# Altium project MainBoard_V100.PrjPcb (part 2 of 3)

## Sheet MainBoard_V100_BLR.SchDoc
size A4; SheetNumber: 12; SheetTotal: 22; Title_: Base Line Restorer
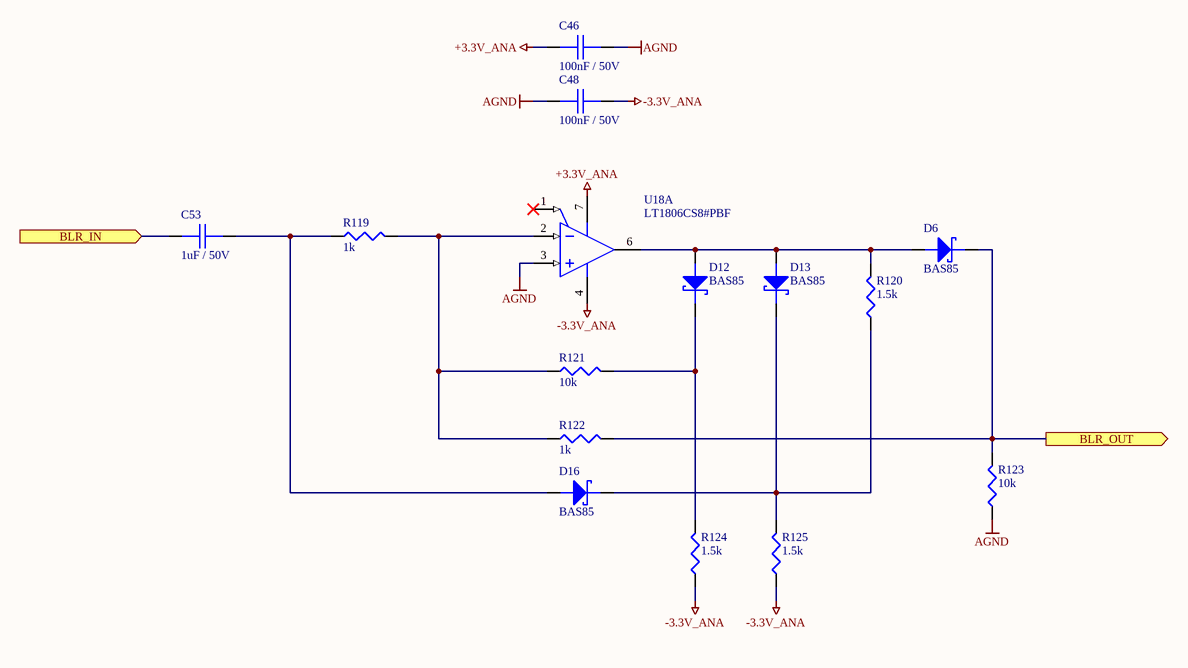
[diagram p10: MainBoard_V100_BLR.SchDoc]

### Parts
C46  100nF / 50V  [0805_C]
C48  100nF / 50V  [0805_C]
C53  1uF / 50V  [0805_C]
D6  BAS85  [SOD80]
D12  BAS85  [SOD80]
D13  BAS85  [SOD80]
D16  BAS85  [SOD80]
R119  1k  [0805]
R120  1.5k  [0805]
R121  10k  [0805]
R122  1k  [0805]
R123  10k  [0805]
R124  1.5k  [0805]
R125  1.5k  [0805]
U18  LT1806CS8#PBF  [SO-8]  (part A of 2)

### Ports
BLR_IN (in), BLR_OUT (out)

### Nets
+3.3V_ANA: C46.1 U18.7(V+)
-3.3V_ANA: C48.2 R124.1 R125.1 U18.4(V-)
AGND: C46.2 C48.1 R123.1 U18.3(+IN)
NetC53_1: C53.1 ; port BLR_IN
NetC53_2: C53.2 D16.A R119.1
NetD6_A: D6.A D12.A D13.A R120.2 U18.6(OUT)
NetD6_K: D6.K R122.2 R123.2 ; port BLR_OUT
NetD12_K: D12.K R121.2 R124.2
NetD13_K: D13.K D16.K R120.1 R125.2
NetR119_2: R119.2 R121.1 R122.1 U18.2(-IN)

Not connected (* = marked no-connect by the designer): U18 1(~{SHDN})*

### Notes on the sheet
- Board:
- Author:
- Title:
- Project:
- SVN:
- Version:
- Sheet:
- of
- Contact:
- Modified:
- Size:
- A4

### Library data of the parts
C46 C48 = 149: as C94 on sheet MainBoard_V100_PSU; Category: Passives; Subcategory: PASS_Capacitor; Supplier 1: HESTORE; Supplier 1 order number: 100.011.22
C53 = 151: 1uF 50V X7R; Part Number: SMD0805-1uF-50V; Azonosító: 151; Category: Passives; Subcategory: PASS_Capacitor; Supplier 1: HESTORE; Supplier 1 order number: 100.330.68
D6 D12 D13 D16 = 371: Small Signal Schottky Diode, Single, 30 V, 200 mA,  125 °C; Azonosító: 371; Part Number: BAS85; Category: Semiconductors; Subcategory: SEMI_Schottky; Supplier 1: HESTORE; Supplier 1 order number: 100.222.42; Supplier 2: FARNELL; Supplier 2 order number: 1097282; Help URL: https://4donline.ihs.com/images/VipMasterIC/IC/NEXP/NEXP-S-A0002881467/NEXP-S-A0002882622-1.pdf?hkey=6D3A4C79FDBF58556ACFDE234799DDF0
R119 R122 = 52: as R40 on sheet MainBoard_V100_PSU_DET; Category: Passives; Subcategory: PASS_Resistor; Supplier 1: HESTORE; Supplier 1 order number: 100.312.99
R120 R124 R125 = 379: 1.5k 0805 0.125W 1%; Part Number: SMD0805-1.5k-1%; Azonosító: 379; Category: Passives; Subcategory: PASS_Resistor; Supplier 1: HESTORE; Supplier 1 order number: 100.327.80
R121 R123 = 59: as R1 on sheet MainBoard_V100_PSU; Category: Passives; Subcategory: PASS_Resistor; Supplier 1: HESTORE; Supplier 1 order number: 100.403.38
U18 = 353: Single Channel, High Speed, Low Noise Precision Operational Amplifier, 325 MHz Typical GBW, 125 V/us Typical SR, 2.5 to 12.6 V, 8-Pin SOIC; Manufacturer: Linear Technology; Linear Technology Part Number: LT1806; Is (mA) Typical: 9; GBW (MHz) Typical: 325; SR (V/us) Typical: 125; Vos (mV) Guaranteed: 0.55; Vos (mV) Typical: 0.1; Vs Max (V): 12.6; Vs Min (V): 2.5; Channels (#): 1; Azonosító: 353; DatasheetVersion: Rev. C; ComponentLink3Description: Package Specification; Mounting Technology: Surface Mount; ComponentLink2Description: Datasheet; RevisionNote: URLs updated; PackageDescription: 8-Pin Plastic Small Outline, Body 4.9 x 3.9 mm, Pitch 1.27 mm; PackageVersion: Rev G; RoHS: Pb-Free; Type: VFB; PackageReference: LT-S8-8; ComponentLink2URL: http://cds.linear.com/docs/en/datasheet/18067fc.pdf; ComponentLink3URL: http://cds.linear.com/docs/en/packaging/05081610_G_SO8.pdf; PartNumber: LT1806CS8#PBF; ComponentLink1Description: Manufacturer URL; ComponentLink1URL: http://www.linear.com/; Part Number: LT1806CS8#PBF; Category: Integrated Circuits; Subcategory: IC_Analog; Supplier 1: MOUSER; Supplier 1 order number: 584-LT1806CS8#PBF; Help URL: https://hu.mouser.com/datasheet/2/609/18067fc-3124195.pdf

## Sheet MainBoard_V100_CSP.SchDoc
size A4; SheetNumber: 11; SheetTotal: 22; Title_: Charge Sensitive Preamplifier
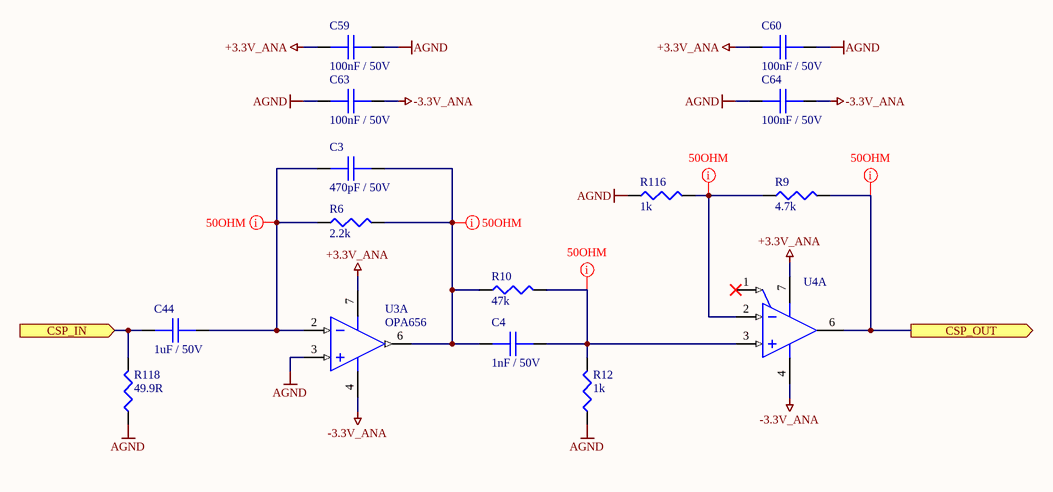
[diagram p11: MainBoard_V100_CSP.SchDoc]

### Parts
C3  470pF / 50V  [0805_C]
C4  1nF / 50V  [0805_C]
C44  1uF / 50V  [0805_C]
C59  100nF / 50V  [0805_C]
C60  100nF / 50V  [0805_C]
C63  100nF / 50V  [0805_C]
C64  100nF / 50V  [0805_C]
R6  2.2k  [0805]
R9  4.7k  [0805]
R10  47k  [0805]
R12  1k  [0805]
R116  1k  [0805]
R118  49.9R  [0805]
U3  OPA656  [SO-8]  (part A of 2)
U4  LT1806CS8#PBF  [SO-8]  (value not drawn)  (part A of 2)

### Ports
CSP_IN (in), CSP_OUT (out)

### Nets
+3.3V_ANA: C59.1 C60.1 U3.7(VS+) U4.7(V+)
-3.3V_ANA: C63.2 C64.2 U3.4(VS-) U4.4(V-)
AGND: C59.2 C60.2 C63.1 C64.1 R12.1 R116.1 R118.1 U3.3(IN+)
NetC3_1: C3.1 C4.1 R6.1 R10.1 U3.6(OUT)
NetC3_2: C3.2 C44.2 R6.2 U3.2(IN-)
NetC4_2: C4.2 R10.2 R12.2 U4.3(+IN)
NetC44_1: C44.1 R118.2 ; port CSP_IN
NetR9_1: R9.1 R116.2 U4.2(-IN)
NetR9_2: R9.2 U4.6(OUT) ; port CSP_OUT

Not connected (* = marked no-connect by the designer): U4 1(~{SHDN})*

### Layout directives
net class 50R: NetC3_1, NetC3_2, NetC4_2, NetR9_1, NetR9_2

### Notes on the sheet
- Board:
- Author:
- Title:
- Project:
- SVN:
- Version:
- Sheet:
- of
- Contact:
- Modified:
- Size:
- A4

### Library data of the parts
C3 = 143: 470 pF 50V X7R; Part Number: SMD0805-470pF-50V; Azonosító: 143; Category: Passives; Subcategory: PASS_Capacitor; Supplier 1: HESTORE; Supplier 1 order number: 100.011.35
C4 = 144: 1nF 50V X7R; Part Number: SMD0805-1nF-50V; Azonosító: 144; Category: Passives; Subcategory: PASS_Capacitor; Supplier 1: HESTORE; Supplier 1 order number: 100.200.70
C44 = 151: as C53 on sheet MainBoard_V100_BLR; Category: Passives; Subcategory: PASS_Capacitor; Supplier 1: HESTORE; Supplier 1 order number: 100.330.68
C59 C60 C63 C64 = 149: as C94 on sheet MainBoard_V100_PSU; Category: Passives; Subcategory: PASS_Capacitor; Supplier 1: HESTORE; Supplier 1 order number: 100.011.22
R6 = 54: 2.2k 0805 0.125W 5%; Part Number: SMD0805-2.2k 5%; Azonosító: 54; Category: Passives; Subcategory: PASS_Resistor; Supplier 1: HESTORE; Supplier 1 order number: 100.406.77
R9 = 56: 4.7k 0805 0.125W 5%; Part Number: SMD0805-4.7k 5%; Azonosító: 56; Category: Passives; Subcategory: PASS_Resistor; Supplier 1: HESTORE; Supplier 1 order number: 100.011.83
R10 = 63: 47k 0805 0.125W 5%; Part Number: SMD0805-47k 5%; Azonosító: 63; Category: Passives; Subcategory: PASS_Resistor; Supplier 1: HESTORE; Supplier 1 order number: 100.011.81
R12 R116 = 52: as R40 on sheet MainBoard_V100_PSU_DET; Category: Passives; Subcategory: PASS_Resistor; Supplier 1: HESTORE; Supplier 1 order number: 100.312.99
R118 = 43: 49.9R 0805 0.125W 1%; Part Number: SMD0805-49.9R 1%; Azonosító: 43; Category: Passives; Subcategory: PASS_Resistor; Supplier 1: HESTORE; Supplier 1 order number: 100.317.46
U3 = 357: Wideband, Unity Gain Stable FET-Input Operational Amplifier, 10 to 12 V, -40 to 85 degC, 8-pin SOIC; PartNumber: OPA656U; Manufacturer: Texas Instruments; BW @ Acl(MHz): 500; Acl, min stable gain(V/V): 1; THD (Fc is 1 MHz)(Typ)(dB): -74; Io(Typ)(mA): 70; @ MHz: 5; Vn at Flatband(Typ)(nV/rtHz): 7; 3rd Harmonic(dBc): 100; Slew Rate(Typ)(V/us): 290; 2nd Harmonic(dBc): 74; Vs(Min)(V): 10; Vs(Max)(V): 12; Iib(Max)(nA): 0.02; Settling Time (0.1%)(Typ)(ns): 16; Vio(Max)(mV): 0.6; Diff Phase(deg): 0.05; Eco-Plan: Green (RoHS & no Sb/Br); Sub Family: High Output Current Amplifier (>=50mA), High Speed Amplifier (>=50MHz), Low Input Bias Current Amp (<=10pA); Azonosító: 357; ComponentLink1URL: http://www.ti.com/; ComponentLink2URL: http://www.ti.com/general/docs/lit/getliterature.tsp?genericPartNumber=OPA656&fileType=pdf; Mounting Technology: Surface Mount; Code_JEDEC: MS-012; PackageReference: D0008A; ComponentLink3URL: http://www.ti.com/litv/pdf/msoi002j; PackageVersion: 4040047-3/M, 06/2011; ComponentLink3Description: Package Specification; Number of Channels: 1; DatasheetVersion: SBOS196G; Iq per channel(Max)(mA): 16; ComponentLink2Description: Datasheet; ComponentLink1Description: Manufacturer URL; Diff Gain(%): 0.02; PackageDescription: 8-Pin Plastic Small Outline, Body 4.9 x 3.9 mm, Pitch 1.27 mm; Part Number: OPA656; Category: Integrated Circuits; Subcategory: IC_Analog; Supplier 1: MOUSER; Supplier 1 order number: 595-OPA656U; Supplier 2: DIGIKEY; Supplier 2 order number: OPA656U-ND; Help URL: https://www.ti.com/lit/ds/symlink/opa656.pdf?HQS=dis-mous-null-mousermode-dsf-pf-null-wwe&ts=1703783263659&ref_url=https%253A%252F%252Fhu.mouser.com%252F
U4 = 353: as U18 on sheet MainBoard_V100_BLR; DatasheetVersion: Rev. C; ComponentLink3Description: Package Specification; Mounting Technology: Surface Mount; ComponentLink2Description: Datasheet; RevisionNote: URLs updated; PackageDescription: 8-Pin Plastic Small Outline, Body 4.9 x 3.9 mm, Pitch 1.27 mm; PackageVersion: Rev G; RoHS: Pb-Free; Type: VFB; PackageReference: LT-S8-8; ComponentLink2URL: http://cds.linear.com/docs/en/datasheet/18067fc.pdf; ComponentLink3URL: http://cds.linear.com/docs/en/packaging/05081610_G_SO8.pdf; PartNumber: LT1806CS8#PBF; ComponentLink1Description: Manufacturer URL; ComponentLink1URL: http://www.linear.com/; Part Number: LT1806CS8#PBF; Category: Integrated Circuits; Subcategory: IC_Analog; Supplier 1: MOUSER; Supplier 1 order number: 584-LT1806CS8#PBF; Help URL: https://hu.mouser.com/datasheet/2/609/18067fc-3124195.pdf

## Sheet MainBoard_V100_PEAKDET.SchDoc
size A4; SheetNumber: 13; SheetTotal: 22; Title_: Peak Detector
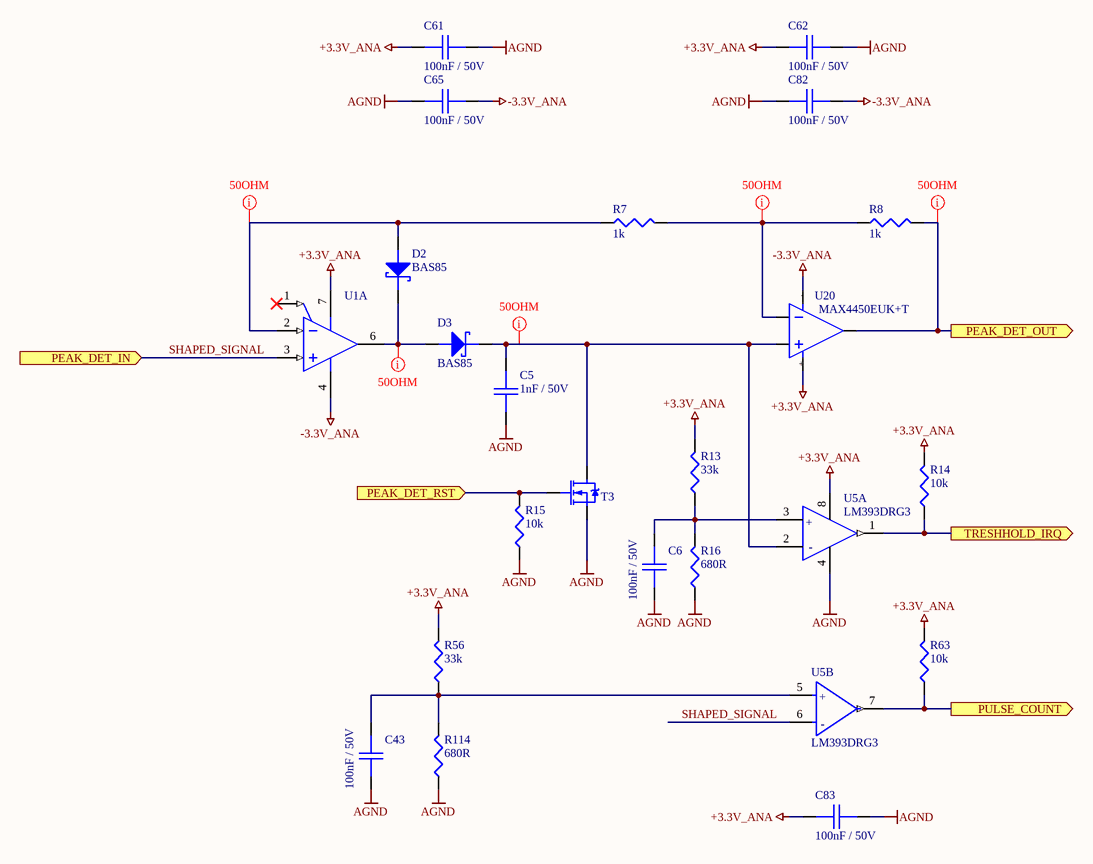
[diagram p12: MainBoard_V100_PEAKDET.SchDoc]

### Parts
C5  1nF / 50V  [0805_C]
C6  100nF / 50V  [0805_C]
C43  100nF / 50V  [0805_C]
C61  100nF / 50V  [0805_C]
C62  100nF / 50V  [0805_C]
C65  100nF / 50V  [0805_C]
C82  100nF / 50V  [0805_C]
C83  100nF / 50V  [0805_C]
D2  BAS85  [SOD80]
D3  BAS85  [SOD80]
R7  1k  [0805]
R8  1k  [0805]
R13  33k  [0805]
R14  10k  [0805]
R15  10k  [0805]
R16  680R  [0805]
R56  33k  [0805]
R63  10k  [0805]
R114  680R  [0805]
T3  2N7002K-7  [SOT-23]  (value not drawn)
U1  LT1806CS8#PBF  [SO-8]  (value not drawn)  (part A of 2)
U5  LM393DRG3  [SO-8]  (parts A,B of 2)
U20  MAX4450EUK+T  [SOT-23-5]

### Ports
PEAK_DET_IN (in), PEAK_DET_OUT (out), PEAK_DET_RST (in), PULSE_COUNT (out), TRESHHOLD_IRQ (out)

### Nets
+3.3V_ANA: C61.1 C62.1 C83.1 R13.2 R14.2 R56.2 R63.2 U1.7(V+) U5.8(Vcc+) U20.5(VCC)
-3.3V_ANA: C65.2 C82.2 U1.4(V-) U20.4(GND)
AGND: C5.2 C6.2 C43.2 C61.2 C62.2 C65.1 C82.1 C83.2 R15.1 R16.1 R114.1 T3.2(S) U5.4(Vcc-)
PEAK_DET_RST: R15.2 T3.1(G) ; port PEAK_DET_RST
PULSE_COUNT: R63.1 U5.7(Out2) ; port PULSE_COUNT
SHAPED_SIGNAL: U1.3(+IN) U5.6(In2-) ; port PEAK_DET_IN
TRESHHOLD_IRQ: R14.1 U5.1(Out1) ; port TRESHHOLD_IRQ
NetC5_1: C5.1 D3.K T3.3(D) U5.2(In1-) U20.3(+)
NetC6_1: C6.1 R13.1 R16.2 U5.3(In1+)
NetC43_1: C43.1 R56.1 R114.2 U5.5(In2+)
NetD2_A: D2.A R7.1 U1.2(-IN)
NetD2_K: D2.K D3.A U1.6(OUT)
NetR7_2: R7.2 R8.1 U20.4(-)
NetR8_2: R8.2 U20.1(OUT) ; port PEAK_DET_OUT

Not connected (* = marked no-connect by the designer): U1 1(~{SHDN})*

### Layout directives
net class 50R: NetC5_1, NetD2_A, NetD2_K, NetR7_2, NetR8_2

### Notes on the sheet
- Board:
- Author:
- Title:
- Project:
- SVN:
- Version:
- Sheet:
- of
- Contact:
- Modified:
- Size:
- A4
- (in symbol 351, part A) +; -
- (in symbol 351, part B) +; -

### Library data of the parts
C5 = 144: as C4 on sheet MainBoard_V100_CSP; Category: Passives; Subcategory: PASS_Capacitor; Supplier 1: HESTORE; Supplier 1 order number: 100.200.70
C6 C43 C61 C62 C65 C82 C83 = 149: as C94 on sheet MainBoard_V100_PSU; Category: Passives; Subcategory: PASS_Capacitor; Supplier 1: HESTORE; Supplier 1 order number: 100.011.22
D2 D3 = 371: as D6 on sheet MainBoard_V100_BLR; Part Number: BAS85; Category: Semiconductors; Subcategory: SEMI_Schottky; Supplier 1: HESTORE; Supplier 1 order number: 100.222.42; Supplier 2: FARNELL; Supplier 2 order number: 1097282; Help URL: https://4donline.ihs.com/images/VipMasterIC/IC/NEXP/NEXP-S-A0002881467/NEXP-S-A0002882622-1.pdf?hkey=6D3A4C79FDBF58556ACFDE234799DDF0
R7 R8 = 52: as R40 on sheet MainBoard_V100_PSU_DET; Category: Passives; Subcategory: PASS_Resistor; Supplier 1: HESTORE; Supplier 1 order number: 100.312.99
R13 R56 = 62: 33k 0805 0.125W 5%; Part Number: SMD0805-33k 5%; Azonosító: 62; Category: Passives; Subcategory: PASS_Resistor; Supplier 1: HESTORE; Supplier 1 order number: 100.449.27
R14 R15 R63 = 59: as R1 on sheet MainBoard_V100_PSU; Category: Passives; Subcategory: PASS_Resistor; Supplier 1: HESTORE; Supplier 1 order number: 100.403.38
R16 R114 = 51: 680R 0805 0.125W 5%; Part Number: SMD0805-680R 5%; Azonosító: 51; Category: Passives; Subcategory: PASS_Resistor; Supplier 1: HESTORE; Supplier 1 order number: 100.011.90
T3 = 315: 2N7002K-7 Power MOSFET, N Channel, 60 V, 300 mA, 2 ohm, SOT-23, Surface Mount; Azonosító: 315; Part Number: 2N7002K-7; Category: Semiconductors; Subcategory: SEMI_FET; Supplier 1: HESTORE; Supplier 1 order number: 100.411.92; Supplier 2: MOUSER; Supplier 2 order number: 621-2N7002K-7; Help URL: https://hu.mouser.com/datasheet/2/115/DIOD_S_A0012992590_1-2543827.pdf
U1 = 353: as U18 on sheet MainBoard_V100_BLR; DatasheetVersion: Rev. C; ComponentLink3Description: Package Specification; Mounting Technology: Surface Mount; ComponentLink2Description: Datasheet; RevisionNote: URLs updated; PackageDescription: 8-Pin Plastic Small Outline, Body 4.9 x 3.9 mm, Pitch 1.27 mm; PackageVersion: Rev G; RoHS: Pb-Free; Type: VFB; PackageReference: LT-S8-8; ComponentLink2URL: http://cds.linear.com/docs/en/datasheet/18067fc.pdf; ComponentLink3URL: http://cds.linear.com/docs/en/packaging/05081610_G_SO8.pdf; PartNumber: LT1806CS8#PBF; ComponentLink1Description: Manufacturer URL; ComponentLink1URL: http://www.linear.com/; Part Number: LT1806CS8#PBF; Category: Integrated Circuits; Subcategory: IC_Analog; Supplier 1: MOUSER; Supplier 1 order number: 584-LT1806CS8#PBF; Help URL: https://hu.mouser.com/datasheet/2/609/18067fc-3124195.pdf
U5 = 351: IC VOLT COMPARATOR DUAL LP 8SOIC; Manufacturer Part Number: LM393D; Manufacturer: STMicroelectronics; Response Time: 1.3us; Min Supply Voltage: 2V; Input Offset Voltage: 1mV; Input Bias Current: 0.02uA; Max Dual Supply Voltage: 18V; Output Current Per Channel: 18mA; Max Junction Temp: +150°C; Standoff Height: 0.1mm; Number Of Channels: 2; Nominal Supply Current: 0.45-0.6mA; Voltage Gain: 200V/mV; Max Supply Voltage: 36V; Min Dual Supply Voltage: 1V; Azonosító: 351; Ambient Temperature Range Low: 0°C; ComponentLink2Description: Datasheet; Lead Free: Yes; Device Class L3: Comparators; Device Class L2: Linear ICs; Digikey Description: IC VOLT COMPARATOR DUAL LP 8SOIC; Category: Integrated Circuits; Octopart: https://octopart.com/lm393d-stmicroelectronics-25832; Package: SO8; RoHS: TRUE; Footprint Url: https://www.st.com/resource/en/datasheet/stm8l001j3.pdf; Temperature Range Low: 0°C; Temperature Range High: +70°C; Mouser Description: Analog Comparators Lo-Pwr Dual Voltage; ComponentLink2URL: https://www.st.com/resource/en/datasheet/lm393.pdf; Automotive: No; Temperature: 0°C to +70°C; Height: 1.75mm; Device Class L1: Integrated Circuits (ICs); Ambient Temperature Range High: +70°C; Part Number: LM393DRG3; Subcategory: IC_Analog; Supplier 1: MOUSER; Supplier 1 order number: 595-LM393DRG3; Help URL: https://www.ti.com/general/docs/suppproductinfo.tsp?distId=26&gotoUrl=https://www.ti.com/lit/gpn/lm393
U20 = 193: Operational Amplifier, Rail to Rail Output, SOT-23-5, 210 MHz, 485 V/µs; Azonosító: 193; Part Number: MAX4450EUK+T; Category: Integrated Circuits; Subcategory: ICs__Analog; Supplier 1: MOUSER; Supplier 1 order number: 700-MAX4450EUKT; Supplier 2: FARNELL; Supplier 2 order number: 2511061; Help URL: https://hu.mouser.com/datasheet/2/609/MAX4450_MAX4451-3129836.pdf

## Sheet MainBoard_V100_MEM.SchDoc
size A4; SheetNumber: 11; SheetTotal: 19; Title_: External EEPROM Memory
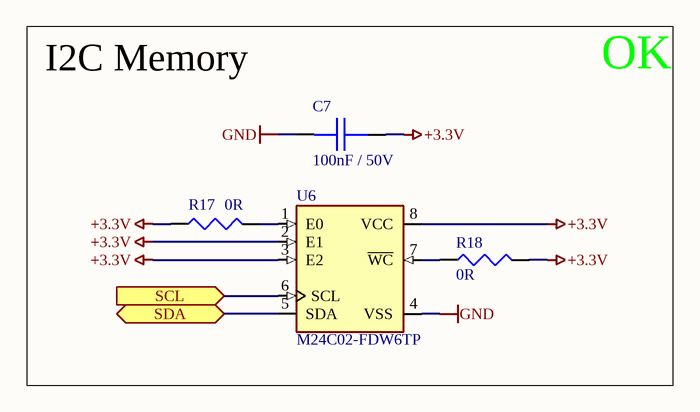
[diagram p13: MainBoard_V100_MEM.SchDoc]

### Parts
C7  100nF / 50V  [0805_C]
R17  0R  [0805]
R18  0R  [0805]
U6  M24C02-FDW6TP  [TSSOP-8]

### Ports
SCL (in), SDA (bidir)

### Nets
+3.3V: C7.2 R17.1 R18.2 U6.2(E1) U6.3(E2) U6.8(VCC)
GND: C7.1 U6.4(VSS)
SCL: U6.6(SCL) ; port SCL
SDA: U6.5(SDA) ; port SDA
NetR17_2: R17.2 U6.1(E0)
NetR18_1: R18.1 U6.7(~{WC})

### Notes on the sheet
- I2C Memory
- OK
- Board:
- Author:
- Title:
- Project:
- SVN:
- Version:
- Sheet:
- of
- Contact:
- Modified:
- Size:
- A4

### Library data of the parts
C7 = 149: as C94 on sheet MainBoard_V100_PSU; Category: Passives; Subcategory: PASS_Capacitor; Supplier 1: HESTORE; Supplier 1 order number: 100.011.22
R17 R18 = 38: as R44 on sheet MainBoard_V100_PSU_DET; Category: Passives; Subcategory: PASS_Resistor; Supplier 1: HESTORE; Supplier 1 order number: 100.275.70
U6 = 345: EEPROM Memory IC 2Kb (256 x 8) I2C 400kHz 900ns 8-TSSOP; MF: STMicroelectronics; Azonosító: 345; Package: TSSOP-8 STMicroelectronics; MP: M24C02-FDW6TP; Digi-Key_Part_Number: 497-15746-1-ND; Value: *; SnapEDA_Link: https://www.snapeda.com/parts/M24C02-FDW6TP/STMicroelectronics/view-part/1102461/?ref=snap; Part Number: M24C02-FDW6TP; Category: Integrated Circuits; Subcategory: IC_Memory; Supplier 1: MOUSER; Supplier 1 order number: 511-M24C02-FDW6TP; Help URL: https://www.st.com/resource/en/datasheet/m24c01-w.pdf

## Sheet MainBoard_V100_ON_OFF.SchDoc
size A4; SheetNumber: 15; SheetTotal: 22; Title_: On Off Controller
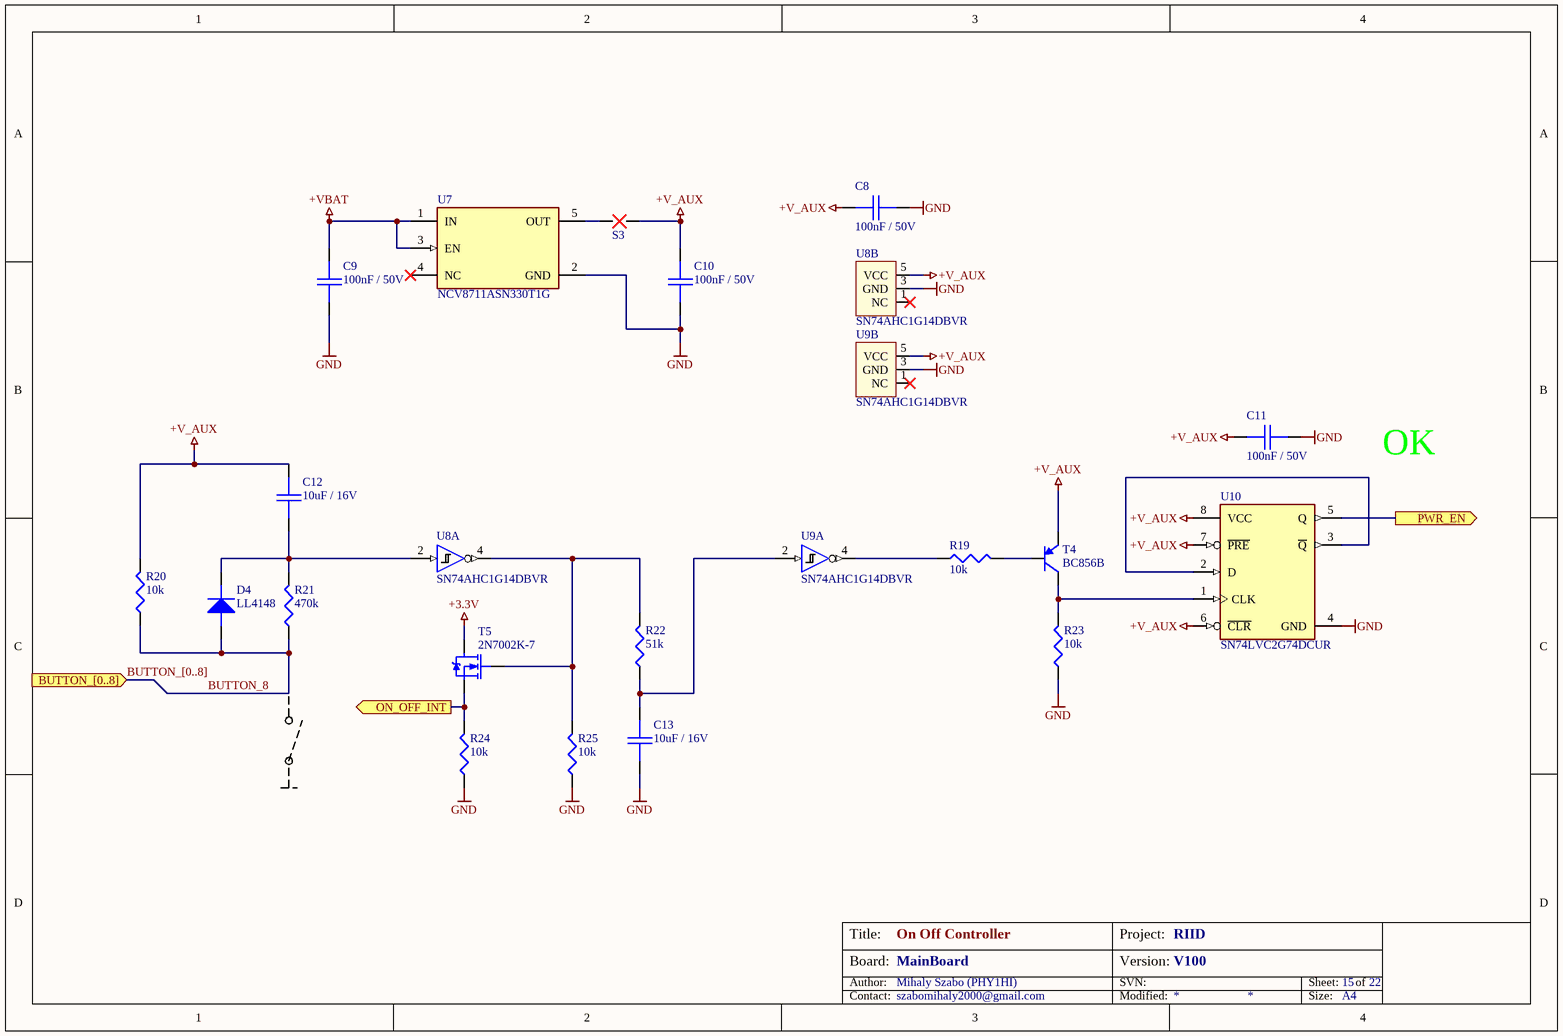
[diagram p14: MainBoard_V100_ON_OFF.SchDoc]

### Parts
C8  100nF / 50V  [0805_C]
C9  100nF / 50V  [0805_C]
C10  100nF / 50V  [0805_C]
C11  100nF / 50V  [0805_C]
C12  10uF / 16V  [0805_C]
C13  10uF / 16V  [0805_C]
D4  LL4148  [SOD80]
R19  10k  [0805]
R20  10k  [0805]
R21  470k  [0805]
R22  51k  [0805]
R23  10k  [0805]
R24  10k  [0805]
R25  10k  [0805]
S3  SPLITER  [SPLITER2_30mil_9mil]  (value not drawn)  (no BOM)
T4  BC856B  [SOT-23]
T5  2N7002K-7  [SOT-23]
U7  NCV8711ASN330T1G  [TSOP-5]
U8  SN74AHC1G14DBVR  [SOT-23-5]  (parts A,B of 2)
U9  SN74AHC1G14DBVR  [SOT-23-5]  (parts A,B of 2)
U10  SN74LVC2G74DCUR  [VSSOP-8_DCU]

### Ports
BUTTON_[0..8] (in), ON_OFF_INT (out), PWR_EN (out)

### Nets
+3.3V: T5.3(D)
+V_AUX: C8.1 C10.2 C11.1 C12.1 R20.2 S3.2 T4.2(E) U8.5(VCC) U9.5(VCC) U10.6(~{CLR}) U10.7(~{PRE}) U10.8(VCC)
+VBAT: C9.2 U7.1(IN) U7.3(EN)
GND: C8.2 C9.1 C10.1 C11.2 C13.2 R23.1 R24.1 R25.1 U7.2(GND) U8.3(GND) U9.3(GND) U10.4(GND)
BUTTON_8: D4.A R20.1 R21.1
ON_OFF_INT: R24.2 T5.2(S) ; port ON_OFF_INT
NetC12_2: C12.2 D4.K R21.2 U8.2(A)
NetC13_1: C13.1 R22.1 U9.2(A)
NetR19_1: R19.1 U9.4(Y)
NetR19_2: R19.2 T4.1(B)
NetR22_2: R22.2 R25.2 T5.1(G) U8.4(Y)
NetR23_2: R23.2 T4.3(C) U10.1(CLK)
NetS3_1: S3.1 U7.5(OUT)
NetU10_2: U10.2(D) U10.3(~{Q})
NetU10_5: U10.5(Q) ; port PWR_EN

Not connected (* = marked no-connect by the designer): U7 4(NC)*; U8 1(NC)*; U9 1(NC)*

### Buses and harness runs
bus BUTTON_[0..8] = port BUTTON_[0..8]

### Notes on the sheet
- OK
- Board:
- Author:
- Title:
- Project:
- SVN:
- Version:
- Sheet:
- of
- Contact:
- Modified:
- Size:
- A4

### Library data of the parts
C8-C11 = 149: as C94 on sheet MainBoard_V100_PSU; Category: Passives; Subcategory: PASS_Capacitor; Supplier 1: HESTORE; Supplier 1 order number: 100.011.22
C12 C13 = 153: as C50 on sheet MainBoard_V100_PSU_DIG; Category: Passives; Subcategory: PASS_Capacitor; Supplier 1: HESTORE; Supplier 1 order number: 100.344.52
D4 = 372: General Purpose, Power, Switching Small Signal Diode, SOD-80, 100V, 0.15A, 175C; Azonosító: 372; Part Number: LL4148; Category: Semiconductors; Subcategory: SEMI_Diode; Supplier 1: MOUSER; Supplier 1 order number: 637-LL4148; Supplier 2: HESTORE; Supplier 2 order number: 100.230.69; Help URL: https://diotec.com/request/datasheet/ll4148.pdf
R19 R20 R23-R25 = 59: as R1 on sheet MainBoard_V100_PSU; Category: Passives; Subcategory: PASS_Resistor; Supplier 1: HESTORE; Supplier 1 order number: 100.403.38
R21 = 69: 470k 0805 0.125W 1%; Part Number: SMD0805-470k 1%; Azonosító: 69; Category: Passives; Subcategory: PASS_Resistor; Supplier 1: HESTORE; Supplier 1 order number: 100.011.79
R22 = 64: 51k 0805 0.125W 5%; Part Number: SMD0805-51k 5%; Azonosító: 64; Category: Passives; Subcategory: PASS_Resistor; Supplier 1: HESTORE; Supplier 1 order number: 100.201.72
S3 = 272: SPLITER2_30mil_9mil; Azonosító: 272; Part Number: SPLITER2_30mil_9mil; Category: Accessories; Subcategory: ACCE_Other
T4 = 312: BC856B Bipolar (BJT) Single Transistor, PNP, 65 V, 100 mA, 250 mW, SOT-23, Surface Mount; Azonosító: 312; Part Number: BC856B; Category: Semiconductors; Subcategory: SEMI_Transistor; Supplier 1: HESTORE; Supplier 1 order number: 100.001.06; Supplier 2: MOUSER; Supplier 2 order number: 637-BC856B; Help URL: https://hu.mouser.com/datasheet/2/849/bc856-3324318.pdf
T5 = 315: as T3 on sheet MainBoard_V100_PEAKDET; Part Number: 2N7002K-7; Category: Semiconductors; Subcategory: SEMI_FET; Supplier 1: HESTORE; Supplier 1 order number: 100.411.92; Supplier 2: MOUSER; Supplier 2 order number: 621-2N7002K-7; Help URL: https://hu.mouser.com/datasheet/2/115/DIOD_S_A0012992590_1-2543827.pdf
U7 = 390: LDO Regulator, 100 mA, 18 V, 1 uA IQ, with PG 3V3 TSOP5; Azonosító: 390; Part Number: NCV8711ASN330T1G; Category: Integrated Circuits; Subcategory: IC_Power; Supplier 1: MOUSER; Supplier 1 order number: 863-NCV8711ASN330T1G; Help URL: https://hu.mouser.com/datasheet/2/308/1/NCV8711_D-2317577.pdf
U8 U9 = 348: Single Inverting Schmitt-Trigger; Azonosító: 348; Part Number: SN74AHC1G14DBVR; Category: Integrated Circuits; Subcategory: IC_Logic; Supplier 1: MOUSER; Supplier 1 order number: 595-SN74AHC1G14DBVR; Supplier 2: FARNELL; Supplier 2 order number: 3120311; Help URL: https://www.ti.com/general/docs/suppproductinfo.tsp?distId=26&gotoUrl=https://www.ti.com/lit/gpn/sn74ahc1g14
U10 = 349: Flip-Flop, 74LVC74, D, 4.1 ns, 200 MHz, 32 mA, VSSOP; Azonosító: 349; Part Number: SN74LVC2G74DCUR; Category: Integrated Circuits; Subcategory: IC_Logic; Supplier 1: MOUSER; Supplier 1 order number: 595-SN74LVC2G74DCUR; Supplier 2: FARNELL; Supplier 2 order number: 3006409; Help URL: https://www.ti.com/general/docs/suppproductinfo.tsp?distId=26&gotoUrl=https://www.ti.com/lit/gpn/sn74lvc2g74

## Sheet MainBoard_V100_SD.SchDoc
size A4; SheetNumber: 14; SheetTotal: 19; Title_: SD Card Connector
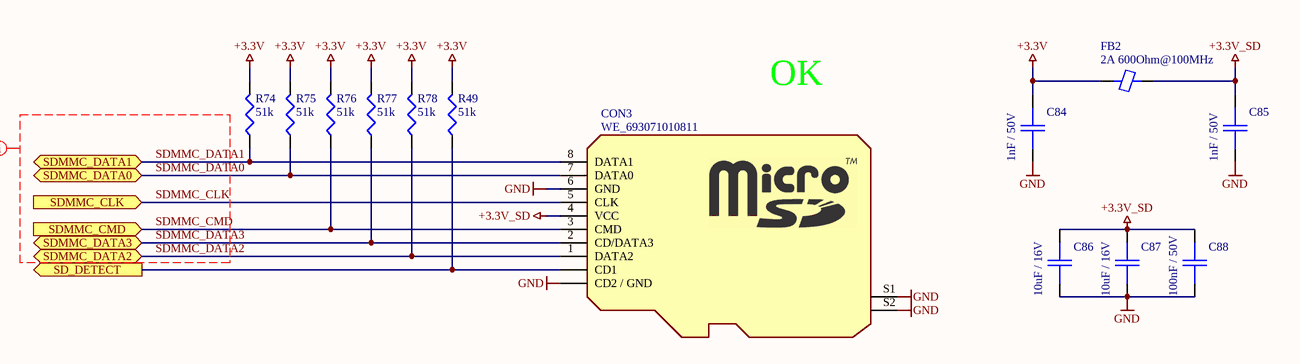
[diagram p15: MainBoard_V100_SD.SchDoc]

### Parts
C84  1nF / 50V  [0805_C]
C85  1nF / 50V  [0805_C]
C86  10uF / 16V  [0805_C]
C87  10uF / 16V  [0805_C]
C88  100nF / 50V  [0805_C]
CON3  WE_693071010811  [T_Wurth_693071010811]
FB2  2A 600Ohm@100MHz  [0805_FB]
R49  51k  [0805]
R74  51k  [0805]
R75  51k  [0805]
R76  51k  [0805]
R77  51k  [0805]
R78  51k  [0805]

### Ports
SD_DETECT (out), SDMMC_CLK (in), SDMMC_CMD (in), SDMMC_DATA0 (bidir), SDMMC_DATA1 (bidir), SDMMC_DATA2 (bidir), SDMMC_DATA3 (bidir)

### Nets
+3.3V: C84.1 FB2.1 R49.2 R74.2 R75.2 R76.2 R77.2 R78.2
+3.3V_SD: C85.1 C86.2 C87.2 C88.1 CON3.4(VCC) FB2.2
GND: C84.2 C85.2 C86.1 C87.1 C88.2 CON3.6(GND) CON3.CD2(CD2_/_GND) CON3.S1(S) CON3.S2(S)
SD_DETECT: CON3.CD1 R49.1 ; port SD_DETECT
SDMMC_CLK: CON3.5(CLK) ; port SDMMC_CLK
SDMMC_CMD: CON3.3(CMD) R76.1 ; port SDMMC_CMD
SDMMC_DATA0: CON3.7(DATA0) R75.1 ; port SDMMC_DATA0
SDMMC_DATA1: CON3.8(DATA1) R74.1 ; port SDMMC_DATA1
SDMMC_DATA2: CON3.1(DATA2) R78.1 ; port SDMMC_DATA2
SDMMC_DATA3: CON3.2(CD/DATA3) R77.1 ; port SDMMC_DATA3

### Layout directives
net class SD_MMC: SDMMC_CLK, SDMMC_CMD, SDMMC_DATA0, SDMMC_DATA1, SDMMC_DATA2, SDMMC_DATA3

### Notes on the sheet
- OK
- Board:
- Author:
- Title:
- Project:
- SVN:
- Version:
- Sheet:
- of
- Contact:
- Modified:
- Size:
- A4

### Library data of the parts
C84 C85 = 144: as C4 on sheet MainBoard_V100_CSP; Category: Passives; Subcategory: PASS_Capacitor; Supplier 1: HESTORE; Supplier 1 order number: 100.200.70
C86 C87 = 153: as C50 on sheet MainBoard_V100_PSU_DIG; Category: Passives; Subcategory: PASS_Capacitor; Supplier 1: HESTORE; Supplier 1 order number: 100.344.52
C88 = 149: as C94 on sheet MainBoard_V100_PSU; Category: Passives; Subcategory: PASS_Capacitor; Supplier 1: HESTORE; Supplier 1 order number: 100.011.22
CON3 = 373: Memory Card Connectors WR-CRD SD Micro Card 8Pin Push & Push; Order Number: 2081363; Azonosító: 373; Supplier: FARNELL; Part Number: WE_693071010811; Category: Connectors; Subcategory: ELME_Other; Supplier 1: MOUSER; Supplier 1 order number: 710-693071010811; Supplier 2: HESTORE; Supplier 2 order number: 100.266.30
FB2 = 183: as FB8 on sheet MainBoard_V100_PSU_DET; Category: Passives; Subcategory: PASS_Other; Supplier 1: HESTORE; Supplier 1 order number: 100.327.86
R49 R74-R78 = 64: as R22 on sheet MainBoard_V100_ON_OFF; Category: Passives; Subcategory: PASS_Resistor; Supplier 1: HESTORE; Supplier 1 order number: 100.201.72

## Sheet MainBoard_V100_USB_MUX.SchDoc
size A4; SheetNumber: 20; SheetTotal: 22; Title_: USB Multiplexer
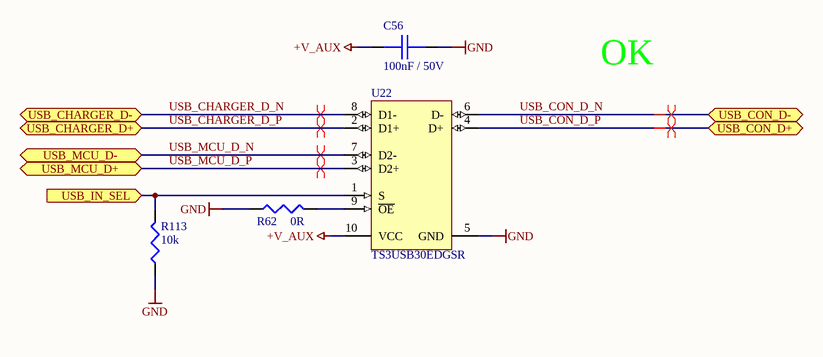
[diagram p16: MainBoard_V100_USB_MUX.SchDoc]

### Parts
C56  100nF / 50V  [0805_C]
R62  0R  [0805]
R113  10k  [0805]
U22  TS3USB30EDGSR  [MSOP-10_P0.5]

### Ports
USB_CHARGER_D+ (bidir), USB_CHARGER_D- (bidir), USB_CON_D+ (bidir), USB_CON_D- (bidir), USB_IN_SEL (in), USB_MCU_D+ (bidir), USB_MCU_D- (bidir)

### Nets
+V_AUX: C56.2 U22.10(VCC)
GND: C56.1 R62.1 R113.1 U22.5(GND)
USB_CHARGER_D_N: U22.8(D1-) ; port USB_CHARGER_D-
USB_CHARGER_D_P: U22.2(D1+) ; port USB_CHARGER_D+
USB_CON_D_N: U22.6(D-) ; port USB_CON_D-
USB_CON_D_P: U22.4(D+) ; port USB_CON_D+
USB_IN_SEL: R113.2 U22.1(S) ; port USB_IN_SEL
USB_MCU_D_N: U22.7(D2-) ; port USB_MCU_D-
USB_MCU_D_P: U22.3(D2+) ; port USB_MCU_D+
NetR62_2: R62.2 U22.9(~{OE})

### Layout directives
differential pair; net class DIFFUSB: USB_CHARGER_D_N, USB_CHARGER_D_P, USB_MCU_D_N, USB_MCU_D_P
differential pair: USB_CON_D_N, USB_CON_D_P

### Notes on the sheet
- OK
- Board:
- Author:
- Title:
- Project:
- SVN:
- Version:
- Sheet:
- of
- Contact:
- Modified:
- Size:
- A4

### Library data of the parts
C56 = 149: as C94 on sheet MainBoard_V100_PSU; Category: Passives; Subcategory: PASS_Capacitor; Supplier 1: HESTORE; Supplier 1 order number: 100.011.22
R62 = 38: as R44 on sheet MainBoard_V100_PSU_DET; Category: Passives; Subcategory: PASS_Resistor; Supplier 1: HESTORE; Supplier 1 order number: 100.275.70
R113 = 59: as R1 on sheet MainBoard_V100_PSU; Category: Passives; Subcategory: PASS_Resistor; Supplier 1: HESTORE; Supplier 1 order number: 100.403.38
U22 = 389: High-Speed USB 2.0 (480-Mbps) 1:2 Multiplexer / Demultiplexer Switch with Single, 10 ohm RON, -40 to 85 degC, 10-Pin MSOP; Azonosító: 389; Part Number: TS3USB30EDGSR; Category: Integrated Circuits; Subcategory: IC_Driver; Supplier 1: MOUSER; Supplier 1 order number: 595-TS3USB30EDGSR; Help URL: https://hu.mouser.com/datasheet/2/115/PERI_S_A0000242924_1-2543936.pdf

## Sheet MainBoard_V100_PER.SchDoc
size A4; SheetNumber: 16; SheetTotal: 22; Title_: Pheripherial Connector
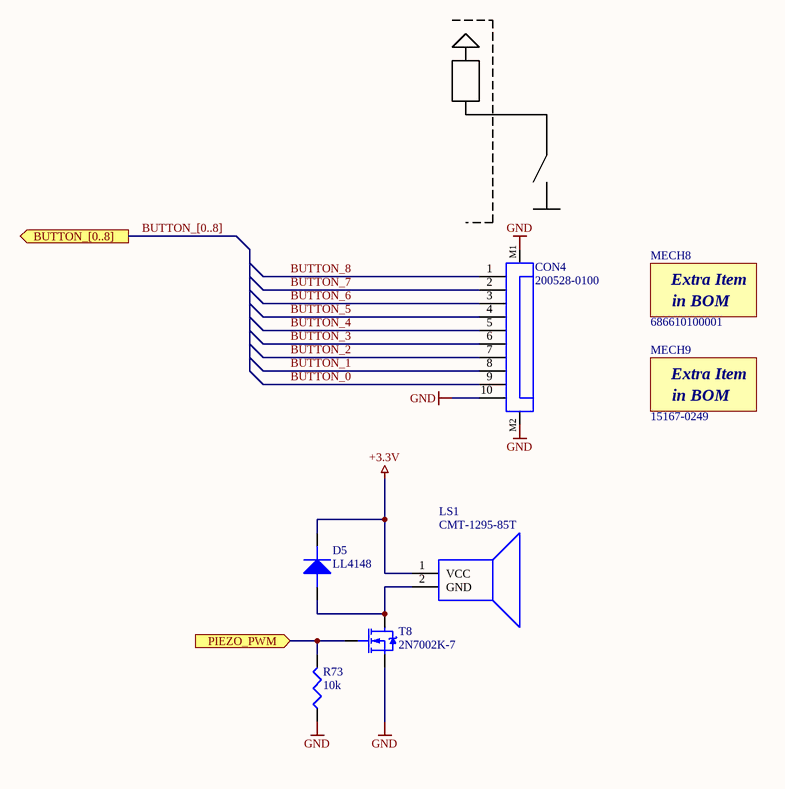
[diagram p17: MainBoard_V100_PER.SchDoc]

### Parts
CON4  200528-0100  [CON_FPC10_1MM_MOLEX_200528-0100]
D5  LL4148  [SOD80]
LS1  CMT-1295-85T  [BUZZER_KXG1205]
MECH8  686610100001  (mechanical)
MECH9  15167-0249  (mechanical)
R73  10k  [0805]
T8  2N7002K-7  [SOT-23]

### Ports
BUTTON_[0..8] (out), PIEZO_PWM (in)

### Nets
+3.3V: D5.K LS1.1(VCC)
GND: CON4.10 CON4.M1 CON4.M2 R73.1 T8.2(S)
BUTTON_0: CON4.9
BUTTON_1: CON4.8
BUTTON_2: CON4.7
BUTTON_3: CON4.6
BUTTON_4: CON4.5
BUTTON_5: CON4.4
BUTTON_6: CON4.3
BUTTON_7: CON4.2
BUTTON_8: CON4.1
NetD5_A: D5.A LS1.2(GND) T8.3(D)
NetR73_2: R73.2 T8.1(G) ; port PIEZO_PWM

### Buses and harness runs
bus BUTTON_[0..8] = port BUTTON_[0..8]

### Notes on the sheet
- Board:
- Author:
- Title:
- Project:
- SVN:
- Version:
- Sheet:
- of
- Contact:
- Modified:
- Size:
- A4
- (in symbol 411) Extra Item; in BOM
- (in symbol 412) Extra Item; in BOM

### Library data of the parts
CON4 = 228: FFC / FPC Board Connector, 1 mm, 10 Contacts, Receptacle, Easy-On, Surface Mount; Part Number: CON_FPC_MOLEX_200528-0100; Azonosító: 228; Category: Connectors; Subcategory: CONN_Board-to-Wire; Supplier 1: MOUSER; Supplier 1 order number: 538-200528-0100; System: Connector
D5 = 372: as D4 on sheet MainBoard_V100_ON_OFF; Part Number: LL4148; Category: Semiconductors; Subcategory: SEMI_Diode; Supplier 1: MOUSER; Supplier 1 order number: 637-LL4148; Supplier 2: HESTORE; Supplier 2 order number: 100.230.69; Help URL: https://diotec.com/request/datasheet/ll4148.pdf
LS1 = 407: Piezo Buzzers & Audio Indicators, 2.4kHz, 12mm, Magnetic, 3V THT; Azonosító: 407; Part Number: CMT-1295-85T; Category: Electro-mechanicals; Subcategory: ELME_Other; Supplier 1: MOUSER; Supplier 1 order number: 179-CMT-1295-85T; Help URL: https://hu.mouser.com/datasheet/2/670/cmt_1295_85t-3388234.pdf
MECH8 = 411: FFC / FPC Jumper Cables WR-FFC 1mm Type 1 10P 100mm length; Azonosító: 411; Part Number: 686610100001; Category: Accessories; Subcategory: ACCE_Other; Supplier 1: MOUSER; Supplier 1 order number: 710-686610100001; Help URL: https://www.we-online.com/components/products/datasheet/686610100001.pdf
MECH9 = 412: FFC / FPC Jumper Cables FFC 1.00mm Type A 10 contact 76mm; Azonosító: 412; Part Number: 15167-0249; Category: Accessories; Subcategory: ACCE_Other; Supplier 1: MOUSER; Supplier 1 order number: 538-15167-0249; Help URL: https://www.molex.com/en-us/products/part-detail/151670249?display=pdf
R73 = 59: as R1 on sheet MainBoard_V100_PSU; Category: Passives; Subcategory: PASS_Resistor; Supplier 1: HESTORE; Supplier 1 order number: 100.403.38
T8 = 315: as T3 on sheet MainBoard_V100_PEAKDET; Part Number: 2N7002K-7; Category: Semiconductors; Subcategory: SEMI_FET; Supplier 1: HESTORE; Supplier 1 order number: 100.411.92; Supplier 2: MOUSER; Supplier 2 order number: 621-2N7002K-7; Help URL: https://hu.mouser.com/datasheet/2/115/DIOD_S_A0012992590_1-2543827.pdf

## Sheet MainBoard_V100_MCU.SchDoc
size A4 portrait; SheetNumber: 18; SheetTotal: 22; Title_: MCU
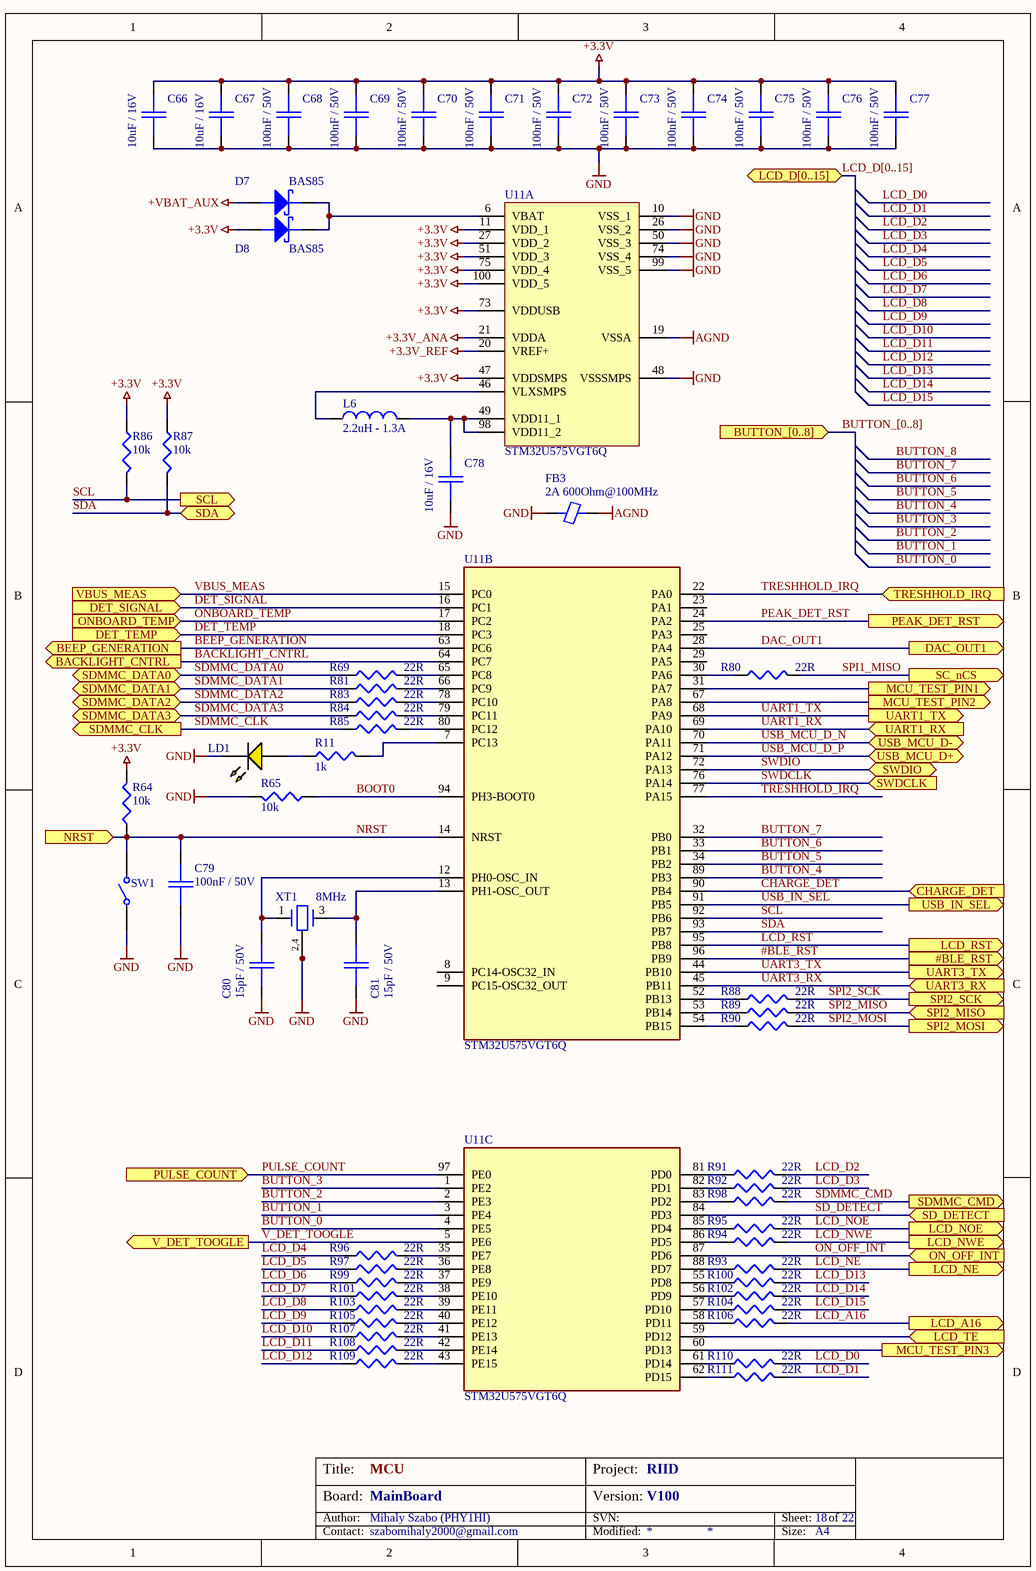
[diagram p18: MainBoard_V100_MCU.SchDoc]

### Parts
C66  10uF / 16V  [0805_C]
C67  10uF / 16V  [0805_C]
C68  100nF / 50V  [0805_C]
C69  100nF / 50V  [0805_C]
C70  100nF / 50V  [0805_C]
C71  100nF / 50V  [0805_C]
C72  100nF / 50V  [0805_C]
C73  100nF / 50V  [0805_C]
C74  100nF / 50V  [0805_C]
C75  100nF / 50V  [0805_C]
C76  100nF / 50V  [0805_C]
C77  100nF / 50V  [0805_C]
C78  10uF / 16V  [0805_C]
C79  100nF / 50V  [0805_C]
C80  15pF / 50V  [0805_C]
C81  15pF / 50V  [0805_C]
D7  BAS85  [SOD80]
D8  BAS85  [SOD80]
FB3  2A 600Ohm@100MHz  [0805_FB]
L6  2.2uH - 1.3A  [0805]
LD1  HSMY-C110 (YEL)  [LED_SMD_90DEG_YEL]  (value not drawn)
R11  1k  [0805]
R64  10k  [0805]
R65  10k  [0603]
R69  22R  [0603]
R80  22R  [0603]
R81  22R  [0603]
R83  22R  [0603]
R84  22R  [0603]
R85  22R  [0603]
R86  10k  [0805]
R87  10k  [0805]
R88  22R  [0603]
R89  22R  [0603]
R90  22R  [0603]
R91  22R  [0603]
R92  22R  [0603]
R93  22R  [0603]
R94  22R  [0603]
R95  22R  [0603]
R96  22R  [0603]
R97  22R  [0603]
R98  22R  [0603]
R99  22R  [0603]
R100  22R  [0603]
R101  22R  [0603]
R102  22R  [0603]
R103  22R  [0603]
R104  22R  [0603]
R105  22R  [0603]
R106  22R  [0603]
R107  22R  [0603]
R108  22R  [0603]
R109  22R  [0603]
R110  22R  [0603]
R111  22R  [0603]
SW1  SW_WE_430181038816  [SW_WE_430181038816]  (value not drawn)
U11  STM32U575VGT6Q  [TQFP-100]  (parts A,B,C of 3)
XT1  8MHz  [XTAL_4pin_5x3.2mm]

### Ports
#BLE_RST (out), BACKLIGHT_CNTRL (out), BEEP_GENERATION (out), BUTTON_[0..8] (in), CHARGE_DET (in), DAC_OUT1 (out), DET_SIGNAL (in), DET_TEMP (in), LCD_A16 (out), LCD_D[0..15] (bidir), LCD_NE (out), LCD_NOE (out), LCD_NWE (out), LCD_RST (out), LCD_TE (in), MCU_TEST_PIN1 (out), MCU_TEST_PIN2 (out), MCU_TEST_PIN3 (out), NRST (in), ON_OFF_INT (in), ONBOARD_TEMP (in), PEAK_DET_RST (out), PULSE_COUNT (in), SC_nCS (out), SCL (out), SD_DETECT (in), SDA (bidir), SDMMC_CLK (out), SDMMC_CMD (out), SDMMC_DATA0 (bidir), SDMMC_DATA1 (bidir), SDMMC_DATA2 (bidir), SDMMC_DATA3 (bidir), SPI2_MISO (in), SPI2_MOSI (out), SPI2_SCK (out), SWDCLK (in), SWDIO (bidir), TRESHHOLD_IRQ (in), UART1_RX (in), UART1_TX (out), UART3_RX (in), UART3_TX (out), USB_IN_SEL (out), USB_MCU_D+ (bidir), USB_MCU_D- (bidir), V_DET_TOOGLE (out), VBUS_MEAS (in)

### Nets
+3.3V: C66.2 C67.2 C68.1 C69.1 C70.1 C71.1 C72.1 C73.1 C74.1 C75.1 C76.1 C77.1 D8.A R64.2 R86.1 R87.1 U11.11(VDD_1) U11.27(VDD_2) U11.47(VDDSMPS) U11.51(VDD_3) U11.73(VDDUSB) U11.75(VDD_4) U11.100(VDD_5)
+3.3V_ANA: U11.21(VDDA)
+3.3V_REF: U11.20(VREF+)
+VBAT_AUX: D7.A
AGND: FB3.2 U11.19(VSSA)
GND: C66.1 C67.1 C68.2 C69.2 C70.2 C71.2 C72.2 C73.2 C74.2 C75.2 C76.2 C77.2 C78.1 C79.2 C80.2 C81.2 FB3.1 LD1.K R65.2 SW1.1 U11.10(VSS_1) U11.26(VSS_2) U11.48(VSSSMPS) U11.50(VSS_3) U11.74(VSS_4) U11.99(VSS_5) XT1.2 XT1.4
#BLE_RST: U11.96(PB9) ; port #BLE_RST
BACKLIGHT_CNTRL: U11.64(PC7) ; port BACKLIGHT_CNTRL
BEEP_GENERATION: U11.63(PC6) ; port BEEP_GENERATION
BOOT0: R65.1 U11.94(PH3-BOOT0)
BUTTON_0: U11.4(PE5)
BUTTON_1: U11.3(PE4)
BUTTON_2: U11.2(PE3)
BUTTON_3: U11.1(PE2)
BUTTON_4: U11.89(PB3)
BUTTON_5: U11.34(PB2)
BUTTON_6: U11.33(PB1)
BUTTON_7: U11.32(PB0)
CHARGE_DET: U11.90(PB4) ; port CHARGE_DET
DAC_OUT1: U11.28(PA4) ; port DAC_OUT1
DET_SIGNAL: U11.16(PC1) ; port DET_SIGNAL
DET_TEMP: U11.18(PC3) ; port DET_TEMP
LCD_A16: R106.2 ; port LCD_A16
LCD_D0: R110.2
LCD_D1: R111.2
LCD_D2: R91.2
LCD_D3: R92.2
LCD_D4: R96.1
LCD_D5: R97.1
LCD_D6: R99.1
LCD_D7: R101.1
LCD_D8: R103.1
LCD_D9: R105.1
LCD_D10: R107.1
LCD_D11: R108.1
LCD_D12: R109.1
LCD_D13: R100.2
LCD_D14: R102.2
LCD_D15: R104.2
LCD_NE: R93.2 ; port LCD_NE
LCD_NOE: R95.2 ; port LCD_NOE
LCD_NWE: R94.2 ; port LCD_NWE
LCD_RST: U11.95(PB8) ; port LCD_RST
LCD_TE: U11.59(PD12) ; port LCD_TE
NRST: C79.1 R64.1 SW1.2 U11.14(NRST) ; port NRST
ON_OFF_INT: U11.87(PD6) ; port ON_OFF_INT
ONBOARD_TEMP: U11.17(PC2) ; port ONBOARD_TEMP
PEAK_DET_RST: U11.24(PA2) ; port PEAK_DET_RST
PULSE_COUNT: U11.97(PE0) ; port PULSE_COUNT
SCL: R86.2 U11.92(PB6) ; port SCL
SD_DETECT: U11.84(PD3) ; port SD_DETECT
SDA: R87.2 U11.93(PB7) ; port SDA
SDMMC_CLK: R85.1 ; port SDMMC_CLK
SDMMC_CMD: R98.2 ; port SDMMC_CMD
SDMMC_DATA0: R69.1 ; port SDMMC_DATA0
SDMMC_DATA1: R81.1 ; port SDMMC_DATA1
SDMMC_DATA2: R83.1 ; port SDMMC_DATA2
SDMMC_DATA3: R84.1 ; port SDMMC_DATA3
SPI1_MISO: R80.2 ; port SC_nCS
SPI2_MISO: R89.2 ; port SPI2_MISO
SPI2_MOSI: R90.2 ; port SPI2_MOSI
SPI2_SCK: R88.2 ; port SPI2_SCK
SWDCLK: U11.76(PA14) ; port SWDCLK
SWDIO: U11.72(PA13) ; port SWDIO
TRESHHOLD_IRQ: U11.22(PA0) U11.77(PA15) ; port TRESHHOLD_IRQ
UART1_RX: U11.69(PA10) ; port UART1_RX
UART1_TX: U11.68(PA9) ; port UART1_TX
UART3_RX: U11.45(PB11) ; port UART3_RX
UART3_TX: U11.44(PB10) ; port UART3_TX
USB_IN_SEL: U11.91(PB5) ; port USB_IN_SEL
USB_MCU_D_N: U11.70(PA11) ; port USB_MCU_D-
USB_MCU_D_P: U11.71(PA12) ; port USB_MCU_D+
V_DET_TOOGLE: U11.5(PE6) ; port V_DET_TOOGLE
VBUS_MEAS: U11.15(PC0) ; port VBUS_MEAS
NetC78_2: C78.2 L6.2 U11.49(VDD11_1) U11.98(VDD11_2)
NetC80_1: C80.1 U11.12(PH0-OSC_IN) XT1.1
NetC81_1: C81.1 U11.13(PH1-OSC_OUT) XT1.3
NetCON7_1: U11.31(PA7) ; port MCU_TEST_PIN1
NetCON7_2: U11.67(PA8) ; port MCU_TEST_PIN2
NetCON7_3: U11.60(PD13) ; port MCU_TEST_PIN3
NetD7_K: D7.K D8.K U11.6(VBAT)
NetL6_1: L6.1 U11.46(VLXSMPS)
NetLD1_A: LD1.A R11.1
NetR11_2: R11.2 U11.7(PC13)
NetR69_2: R69.2 U11.65(PC8)
NetR80_1: R80.1 U11.30(PA6)
NetR81_2: R81.2 U11.66(PC9)
NetR83_2: R83.2 U11.78(PC10)
NetR84_2: R84.2 U11.79(PC11)
NetR85_2: R85.2 U11.80(PC12)
NetR88_1: R88.1 U11.52(PB13)
NetR89_1: R89.1 U11.53(PB14)
NetR90_1: R90.1 U11.54(PB15)
NetR91_1: R91.1 U11.81(PD0)
NetR92_1: R92.1 U11.82(PD1)
NetR93_1: R93.1 U11.88(PD7)
NetR94_1: R94.1 U11.86(PD5)
NetR95_1: R95.1 U11.85(PD4)
NetR96_2: R96.2 U11.35(PE7)
NetR97_2: R97.2 U11.36(PE8)
NetR98_1: R98.1 U11.83(PD2)
NetR99_2: R99.2 U11.37(PE9)
NetR100_1: R100.1 U11.55(PD8)
NetR101_2: R101.2 U11.38(PE10)
NetR102_1: R102.1 U11.56(PD9)
NetR103_2: R103.2 U11.39(PE11)
NetR104_1: R104.1 U11.57(PD10)
NetR105_2: R105.2 U11.40(PE12)
NetR106_1: R106.1 U11.58(PD11)
NetR107_2: R107.2 U11.41(PE13)
NetR108_2: R108.2 U11.42(PE14)
NetR109_2: R109.2 U11.43(PE15)
NetR110_1: R110.1 U11.61(PD14)
NetR111_1: R111.1 U11.62(PD15)

Not connected (* = marked no-connect by the designer): U11 8(PC14-OSC32_IN) 9(PC15-OSC32_OUT) 23(PA1) 25(PA3) 29(PA5)

### Buses and harness runs
bus BUTTON_[0..8] = port BUTTON_[0..8]
bus LCD_D[0..15] = port LCD_D[0..15]

### Notes on the sheet
- Board:
- Author:
- Title:
- Project:
- SVN:
- Version:
- Sheet:
- of
- Contact:
- Modified:
- Size:
- A4
- (in symbol 253) 2,4

### Library data of the parts
C66 C67 C78 = 153: 10uF 16V X5R; Part Number: SMD0805-10uF-16V; Azonosító: 153; Category: Passives; Subcategory: PASS_Capacitor; Supplier 1: HESTORE; Supplier 1 order number: 100.344.52
C68-C77 C79 = 149: 100nF 50V X7R; Part Number: SMD0805-100nF-50V; Azonosító: 149; Category: Passives; Subcategory: PASS_Capacitor; Supplier 1: HESTORE; Supplier 1 order number: 100.011.22
C80 C81 = 135: 15 pF 50V NP0; Part Number: SMD0805-15pF-50V; Azonosító: 135; Category: Passives; Subcategory: PASS_Capacitor; Supplier 1: HESTORE; Supplier 1 order number: 100.011.25
D7 D8 = 371: Small Signal Schottky Diode, Single, 30 V, 200 mA,  125 °C; Azonosító: 371; Part Number: BAS85; Category: Semiconductors; Subcategory: SEMI_Schottky; Supplier 1: HESTORE; Supplier 1 order number: 100.222.42; Supplier 2: FARNELL; Supplier 2 order number: 1097282; Help URL: https://4donline.ihs.com/images/VipMasterIC/IC/NEXP/NEXP-S-A0002881467/NEXP-S-A0002882622-1.pdf?hkey=6D3A4C79FDBF58556ACFDE234799DDF0
FB3 = 183: Ferrite bead 2A 600Ohm@100MHz; Part Number: LCBB-601 SMD; Azonosító: 183; Category: Passives; Subcategory: PASS_Other; Supplier 1: HESTORE; Supplier 1 order number: 100.327.86
L6 = 393: 2.2uH -20% 1.3A; Part Number: LQM21PN2R2MGHL; Azonosító: 393; Category: Passives; Subcategory: PASS_Inductor; Supplier 1: MOUSER; Supplier 1 order number: 81-LQM21PN2R2MGHL; Help URL: https://hu.mouser.com/datasheet/2/281/1/JELF243B_0040-1699501.pdf
LD1 = 291: LED, Yellow, SMD, 20 mA, 2.1 V, 586 nm; Azonosító: 291; Part Number: HSMY-C110; Category: Optoelectronics; Subcategory: OPTO_LED; Supplier 1: MOUSER; Supplier 1 order number: 630-HSMY-C110; Supplier 2: FARNELL; Supplier 2 order number: 3229579; Help URL: https://hu.mouser.com/datasheet/2/678/AV02_0551EN_DS_HSMx_Cxxx_25Mar2022-1827675.pdf
R11 = 52: 1k 0805 0.125W 1%; Part Number: SMD0805-1k 1%; Azonosító: 52; Category: Passives; Subcategory: PASS_Resistor; Supplier 1: HESTORE; Supplier 1 order number: 100.312.99
R64 R86 R87 = 59: 10k 0805 0.125W 1%; Part Number: SMD0805-10k 1%; Azonosító: 59; Category: Passives; Subcategory: PASS_Resistor; Supplier 1: HESTORE; Supplier 1 order number: 100.403.38
R65 = 23: 10k 0603 0.1W 1%; Part Number: SMD0603-10K-1%; Azonosító: 23; Category: Passives; Subcategory: PASS_Resistor; Supplier 1: HESTORE; Supplier 1 order number: 100.239.10
R69 R80 R81 R83-R85 R88-R111 = 10: 22R 0603 0.1W 5%; Part Number: SMD0603-22R-5%; Azonosító: 10; Category: Passives; Subcategory: PASS_Resistor; Supplier 1: HESTORE; Supplier 1 order number: 100.239.27; Help URL: https://www.hestore.hu/prod_getfile.php?id=306
SW1 = 281: SW_WE_430181038816 Tact switch 2 pole; Azonosító: 281; Part Number: WE_430181038816; Category: Electro-mechanicals; Subcategory: ELME_Other Switch; Supplier 1: MOUSER; Supplier 1 order number: 710-430181038816; Supplier 2: DIGIKEY; Supplier 2 order number: 732-7003-1-ND; Help URL: https://www.we-online.com/components/products/datasheet/430181038816.pdf
U11 = 374: ARM® Cortex®-M33 STM32U5 Mikrovezérlő IC 32 bites 160MHz 1MB (1M x 8) FLASH 100-LQFP (14x14); Azonosító: 374; Part Number: STM32U575VGT6Q; Category: Integrated Circuits; Subcategory: IC_MCU-FPGA-DSP; Supplier 1: MOUSER; Supplier 1 order number: 511-STM32U575VGT6Q
XT1 = 253: ABRACON  ABM3B-8.000MHZ-10-1UT  Crystal, 8 MHz, SMD, 5mm x 3.2mm, 10 ppm,18 pF 20 ppm, ABM3B Series 8MHz; Azonosító: 253; Part Number: ABM3B-8.000MHZ-10-1UT; Category: Clock Sources; Subcategory: CLOC_Crystal; Supplier 1: MOUSER; Supplier 1 order number: 815-ABM3B-8.0-10-1UT; Supplier 2: DIGIKEY; Supplier 2 order number: 535-9721-1-ND; Help URL: https://hu.mouser.com/datasheet/2/3/abm3b-1774998.pdf

## Sheet MainBoard_V100_BLE.SchDoc
size A4; SheetNumber: 16; SheetTotal: 19; Title_: BLE Module
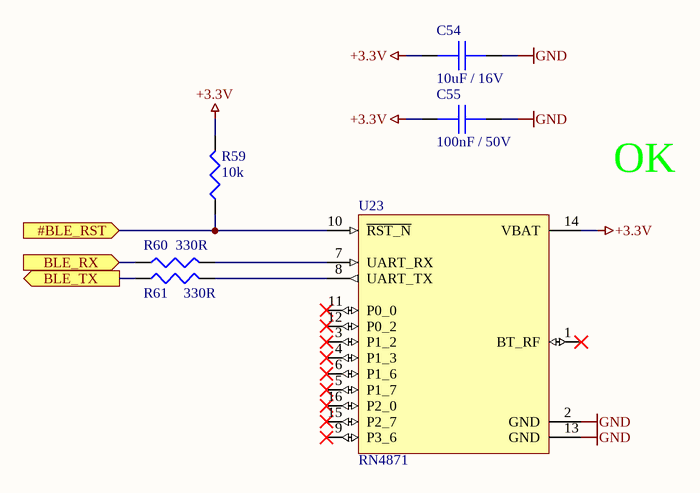
[diagram p19: MainBoard_V100_BLE.SchDoc]

### Parts
C54  10uF / 16V  [0805_C]
C55  100nF / 50V  [0805_C]
R59  10k  [0805]
R60  330R  [0805]
R61  330R  [0805]
U23  RN4871  [RN4871]

### Ports
#BLE_RST (in), BLE_RX (in), BLE_TX (out)

### Nets
+3.3V: C54.2 C55.2 R59.2 U23.14(VBAT)
GND: C54.1 C55.1 U23.2(GND) U23.13(GND)
#BLE_RST: R59.1 U23.10(~{RST_N}) ; port #BLE_RST
NetR60_1: R60.1 ; port BLE_RX
NetR60_2: R60.2 U23.7(UART_RX)
NetR61_1: R61.1 ; port BLE_TX
NetR61_2: R61.2 U23.8(UART_TX)

Not connected (* = marked no-connect by the designer): U23 1(BT_RF)* 3(P1_2)* 4(P1_3)* 5(P1_7)* 6(P1_6)* 9(P3_6)* 11(P0_0)* 12(P0_2)* 15(P2_7)* 16(P2_0)*

### Notes on the sheet
- OK
- Board:
- Author:
- Title:
- Project:
- SVN:
- Version:
- Sheet:
- of
- Contact:
- Modified:
- Size:
- A4

### Library data of the parts
C54 = 153: as C66 on sheet MainBoard_V100_MCU; Category: Passives; Subcategory: PASS_Capacitor; Supplier 1: HESTORE; Supplier 1 order number: 100.344.52
C55 = 149: as C68-C77 on sheet MainBoard_V100_MCU; Category: Passives; Subcategory: PASS_Capacitor; Supplier 1: HESTORE; Supplier 1 order number: 100.011.22
R59 = 59: as R64 on sheet MainBoard_V100_MCU; Category: Passives; Subcategory: PASS_Resistor; Supplier 1: HESTORE; Supplier 1 order number: 100.403.38
R60 R61 = 48: 330R 0805 0.125W 5%; Part Number: SMD0805-330R 5%; Azonosító: 48; Category: Passives; Subcategory: PASS_Resistor; Supplier 1: HESTORE; Supplier 1 order number: 100.011.70
U23 = 391: Bluetooth Modules - 802.15.1 Bluetooth Low Energy BLE Module, Shielded, Antenna,; Azonosító: 391; Part Number: RN4871; Category: Integrated Circuits; Subcategory: IC_RF; Supplier 1: MOUSER; Supplier 1 order number: 579-RN4871-I/RM140; Help URL: https://hu.mouser.com/datasheet/2/268/RN4870_71_Bluetooth_Low_Energy_Module_DS50002489-3002868.pdf

## Sheet MainBoard_V100_DISP.SchDoc
size A4; SheetNumber: 21; SheetTotal: 22; Title_: Display
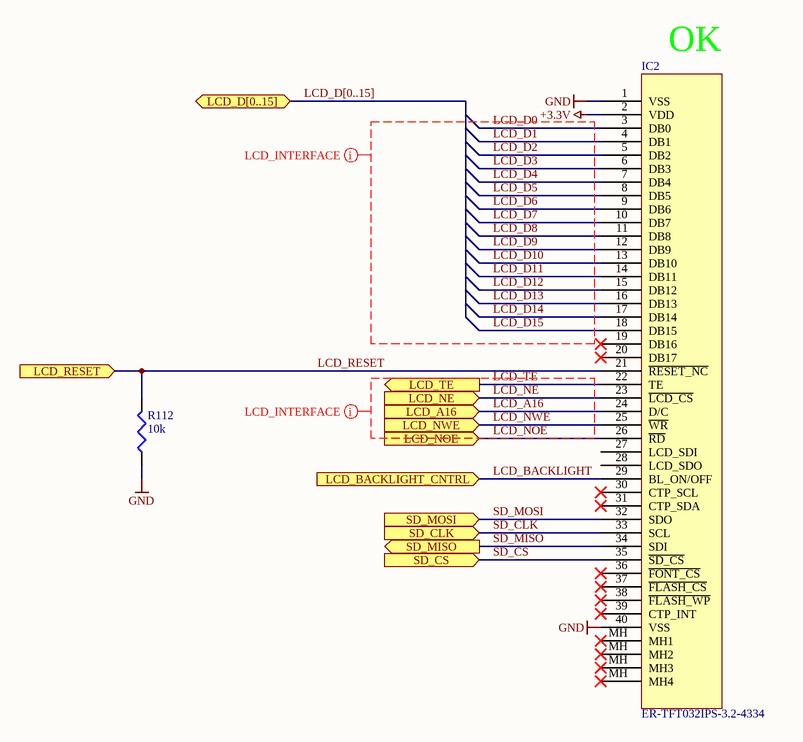
[diagram p20: MainBoard_V100_DISP.SchDoc]

### Parts
IC2  ER-TFT032IPS-3.2-4334  [ER-TFT032IPS-3.2]
R112  10k  [0805]

### Ports
LCD_A16 (in), LCD_BACKLIGHT_CNTRL (in), LCD_D[0..15] (bidir), LCD_NE (in), LCD_NOE (in), LCD_NWE (in), LCD_RESET (in), LCD_TE (out), SD_CLK (in), SD_CS (in), SD_MISO (out), SD_MOSI (in)

### Nets
+3.3V: IC2.2(VDD)
GND: IC2.1(VSS) IC2.40(VSS) R112.1
LCD_A16: IC2.24(D/C) ; port LCD_A16
LCD_BACKLIGHT: IC2.29(BL_ON/OFF) ; port LCD_BACKLIGHT_CNTRL
LCD_D0: IC2.3(DB0)
LCD_D1: IC2.4(DB1)
LCD_D2: IC2.5(DB2)
LCD_D3: IC2.6(DB3)
LCD_D4: IC2.7(DB4)
LCD_D5: IC2.8(DB5)
LCD_D6: IC2.9(DB6)
LCD_D7: IC2.10(DB7)
LCD_D8: IC2.11(DB8)
LCD_D9: IC2.12(DB9)
LCD_D10: IC2.13(DB10)
LCD_D11: IC2.14(DB11)
LCD_D12: IC2.15(DB12)
LCD_D13: IC2.16(DB13)
LCD_D14: IC2.17(DB14)
LCD_D15: IC2.18(DB15)
LCD_NE: IC2.23(~{LCD_CS}) ; port LCD_NE
LCD_NOE: IC2.26(~{RD}) ; port LCD_NOE
LCD_NWE: IC2.25(~{WR}) ; port LCD_NWE
LCD_RESET: IC2.21(~{RESET_NC}) R112.2 ; port LCD_RESET
LCD_TE: IC2.22(TE) ; port LCD_TE
SD_CLK: IC2.33(SCL) ; port SD_CLK
SD_CS: IC2.35(~{SD_CS}) ; port SD_CS
SD_MISO: IC2.34(SDI) ; port SD_MISO
SD_MOSI: IC2.32(SDO) ; port SD_MOSI

Not connected (* = marked no-connect by the designer): IC2 19(DB16)* 20(DB17)* 27(LCD_SDI) 28(LCD_SDO) 30(CTP_SCL)* 31(CTP_SDA)* 36(~{FONT_CS})* 37(~{FLASH_CS})* 38(~{FLASH_WP})* 39(CTP_INT)* MH(MH1)*

### Buses and harness runs
bus LCD_D[0..15] = port LCD_D[0..15]

### Layout directives
net class LCD_INTERFACE: LCD_A16, LCD_D0, LCD_D1, LCD_D2, LCD_D3, LCD_D4, LCD_D5, LCD_D6, LCD_D7, LCD_D8, LCD_D9, LCD_D10, LCD_D11, LCD_D12, LCD_D13, LCD_D14, LCD_D15, LCD_NE, LCD_NOE, LCD_NWE, LCD_TE

### Notes on the sheet
- (near IC2) OK
- Board:
- Author:
- Title:
- Project:
- SVN:
- Version:
- Sheet:
- of
- Contact:
- Modified:
- Size:
- A4

### Library data of the parts
IC2 = 392: 3.2 inch 240x320 IPS TFT LCD Module; Azonosító: 392; Part Number: ER-TFT032IPS-3.2-4334; Category: Optoelectronics; Subcategory: OPTO_Display; Supplier 1: buydisplay.com; Supplier 1 order number: ER-TFT032IPS-3.2-4334; Help URL: https://www.buydisplay.com/download/manual/ER-TFT032IPS-3.2-4334_Datasheet.pdf
R112 = 59: as R64 on sheet MainBoard_V100_MCU; Category: Passives; Subcategory: PASS_Resistor; Supplier 1: HESTORE; Supplier 1 order number: 100.403.38

## Sheet MainBoard_V100_TEMP.SchDoc
size A4; SheetNumber: 22; SheetTotal: 22; Title_: Temperature Sensor
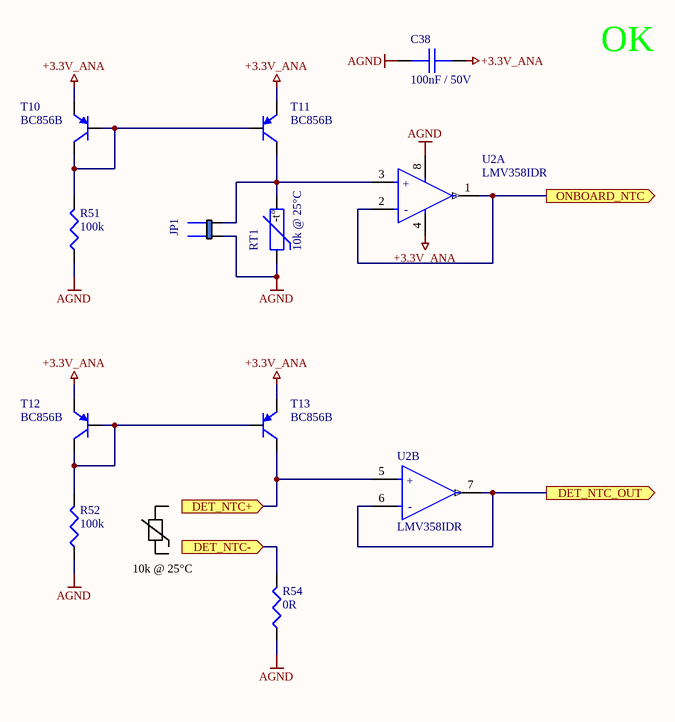
[diagram p21: MainBoard_V100_TEMP.SchDoc]

### Parts
C38  100nF / 50V  [0805_C]
JP1  JUMPER2 2.54MM  [JUMPER_5]  (value not drawn)
R51  100k  [0805]
R52  100k  [0805]
R54  0R  [0805]
RT1  10k @ 25°C  [0805]
T10  BC856B  [SOT-23]
T11  BC856B  [SOT-23]
T12  BC856B  [SOT-23]
T13  BC856B  [SOT-23]
U2  LMV358IDR  [SO-8]  (parts A,B of 2)

### Ports
DET_NTC+ (in), DET_NTC- (in), DET_NTC_OUT (out), ONBOARD_NTC (out)

### Nets
+3.3V_ANA: C38.2 T10.2(E) T11.2(E) T12.2(E) T13.2(E) U2.4(GND)
AGND: C38.1 JP1.1 R51.1 R52.1 R54.1 RT1.1 U2.8(VCC+)
DET_NTC+: T13.3(C) U2.5(2IN+) ; port DET_NTC+
DET_NTC-: R54.2 ; port DET_NTC-
NetJP1_2: JP1.2 RT1.2 T11.3(C) U2.3(1IN+)
NetR51_2: R51.2 T10.1(B) T10.3(C) T11.1(B)
NetR52_2: R52.2 T12.1(B) T12.3(C) T13.1(B)
NetU2_1: U2.1(OUT) U2.2(1IN-) ; port ONBOARD_NTC
NetU2_6: U2.6(2IN-) U2.7(2OUT) ; port DET_NTC_OUT

### Notes on the sheet
- OK
- 10k @ 25°C
- Board:
- Author:
- Title:
- Project:
- SVN:
- Version:
- Sheet:
- of
- Contact:
- Modified:
- Size:
- A4
- (in symbol 325) -t°
- (in symbol 352, part A) +; -
- (in symbol 352, part B) +; -

### Library data of the parts
C38 = 149: as C68-C77 on sheet MainBoard_V100_MCU; Category: Passives; Subcategory: PASS_Capacitor; Supplier 1: HESTORE; Supplier 1 order number: 100.011.22
JP1 = 246: Azonosító: 246; Part Number: JUMPER2 2.54MM; Category: Connectors; Subcategory: CONN_Other; Supplier 1: FARNELL; Supplier 1 order number: 2356153
R51 R52 = 66: 100k 0805 0.125W 5%; Part Number: SMD0805-100k 5%; Azonosító: 66; Category: Passives; Subcategory: PASS_Resistor; Supplier 1: HESTORE; Supplier 1 order number: 100.011.43
R54 = 38: 0R 0805 0.125W 5%; Part Number: 0 R 5%; Azonosító: 38; Category: Passives; Subcategory: PASS_Resistor; Supplier 1: HESTORE; Supplier 1 order number: 100.275.70
RT1 = 325: NTC (Negative Temperature Coefficient) Thermistors THERMISTOR 0805 10K/3435; Part Number: TX08F103F3435ER; Azonosító: 325; Category: Passives; Subcategory: PASS_Other; Supplier 1: MOUSER; Supplier 1 order number: 588-TX08F103F3435ER
T10-T13 = 312: BC856B Bipolar (BJT) Single Transistor, PNP, 65 V, 100 mA, 250 mW, SOT-23, Surface Mount; Azonosító: 312; Part Number: BC856B; Category: Semiconductors; Subcategory: SEMI_Transistor; Supplier 1: HESTORE; Supplier 1 order number: 100.001.06; Supplier 2: MOUSER; Supplier 2 order number: 637-BC856B; Help URL: https://hu.mouser.com/datasheet/2/849/bc856-3324318.pdf
U2 = 352: IC OPAMP GP 2 CIRCUIT 8SOIC; Number of Elements: 2; Min Supply Voltage: 2.7V; Input Bias Current: 250nA; Output Current per Channel: 160mA; Bandwidth: 1MHz; Voltage Gain: 100dB; Input Offset Voltage (Vos): 7mV; Slew Rate: 1V/µs; Nominal Supply Current: 440uA; Power Supply Rejection Ratio (PSRR): 50dB; Max Supply Voltage: 5.5V; Operating Supply Current: 210uA; Azonosító: 352; Lead Free: Lead Free; Length: 4.9mm; RoHS Compliant: Yes; REACH SVHC: No SVHC; Case/Package: SOIC; Height: 1.58mm; Number of Channels: 2; Number of Amplifiers: 2; Radiation Hardening: No; Number of Circuits: 2; Mount: Surface Mount; Contact Plating: Gold; Unity Gain Bandwidth Product: 1MHz; Min Operating Temperature: -40°C; Max Operating Temperature: 125°C; Width: 3.91mm; Gain Bandwidth Product: 1MHz; Number of Pins: 8; Packaging: Tape and Reel; Package Quantity: 2500; Output Current: 160mA; Common Mode Rejection Ratio: 50dB; Part Number: LMV358IDR; Category: Integrated Circuits; Subcategory: IC_Analog; Supplier 1: MOUSER; Supplier 1 order number: 595-LMV358IDRE4; Help URL: https://www.ti.com/lit/ds/symlink/lmv358.pdf?HQS=dis-mous-null-mousermode-dsf-pf-null-wwe&ts=1703732015551